# Altium schematic sheet module_pcb_template.SchDoc: PCI Express F1 Top Sheet
size A4; SheetNumber: 1; SheetTotal: 2
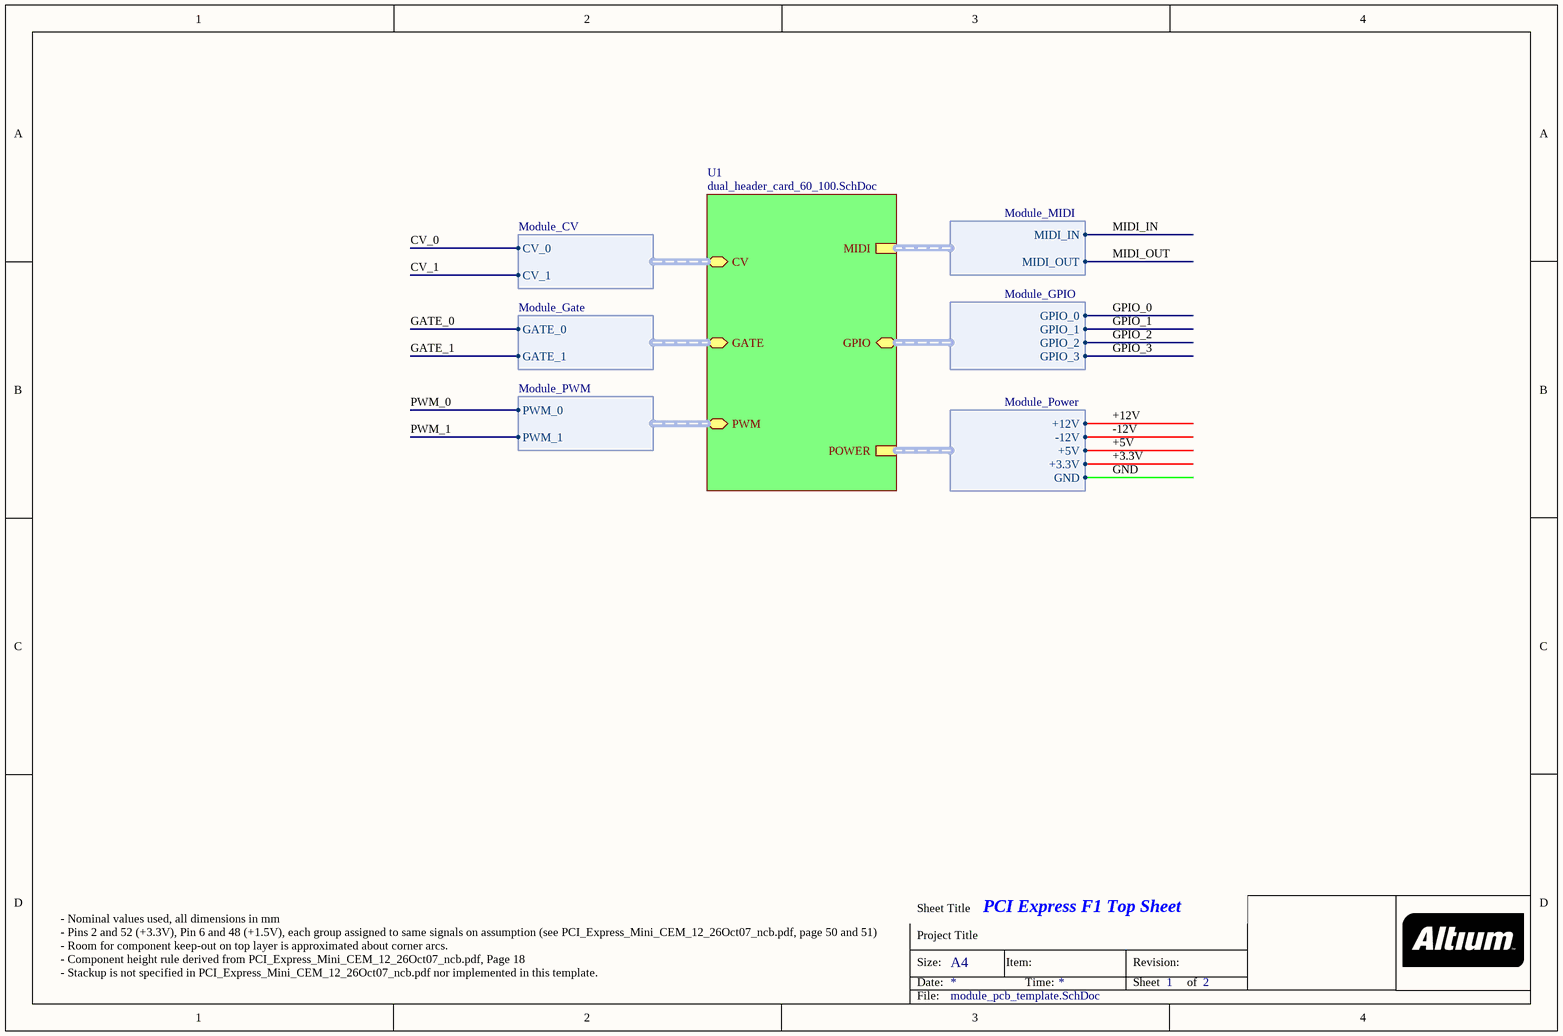
[diagram p0: module_pcb_template.SchDoc]

## Sub-sheets
U1 = dual_header_card_60_100.SchDoc: POWER (harness Module_Power), MIDI (harness Module_MIDI), CV (harness Module_CV), GPIO (harness Module_GPIO), GATE (harness Module_Gate), PWM (harness Module_PWM)

## Harnesses
Module_Power: +12V, +5V, GND, +3.3V, -12V
Module_MIDI: MIDI_IN, MIDI_OUT
Module_GPIO: GPIO_0, GPIO_1, GPIO_2, GPIO_3
Module_PWM: PWM_0, PWM_1
Module_CV: CV_0, CV_1
Module_Gate: GATE_0, GATE_1

## Nets
+3.3V: sheet U1/POWER.+3.3V
+5V: sheet U1/POWER.+5V
+12V: sheet U1/POWER.+12V
-12V: sheet U1/POWER.-12V
CV_0: sheet U1/CV.CV_0
CV_1: sheet U1/CV.CV_1
GATE_0: sheet U1/GATE.GATE_0
GATE_1: sheet U1/GATE.GATE_1
GND: sheet U1/POWER.GND
GPIO_0: sheet U1/GPIO.GPIO_0
GPIO_1: sheet U1/GPIO.GPIO_1
GPIO_2: sheet U1/GPIO.GPIO_2
GPIO_3: sheet U1/GPIO.GPIO_3
MIDI_IN: sheet U1/MIDI.MIDI_IN
MIDI_OUT: sheet U1/MIDI.MIDI_OUT
PWM_0: sheet U1/PWM.PWM_0
PWM_1: sheet U1/PWM.PWM_1

## Notes on the sheet
- - Nominal values used, all dimensions in mm
  - Pins 2 and 52 (+3.3V), Pin 6 and 48 (+1.5V), each group assigned to same signals on assumption (see PCI_Express_Mini_CEM_12_26Oct07_ncb.pdf, page 50 and 51)
  - Room for component keep-out on top layer is approximated about corner arcs.
  - Component height rule derived from PCI_Express_Mini_CEM_12_26Oct07_ncb.pdf, Page 18
  - Stackup is not specified in PCI_Express_Mini_CEM_12_26Oct07_ncb.pdf nor implemented in this template.
- Sheet Title
- Project Title
- Size:
- Date:
- A4
- Item:
- Time:
- Revision:
- Sheet
- of
- File: